# EAGLE schematic WS2811Controller (EAGLE 6.4)
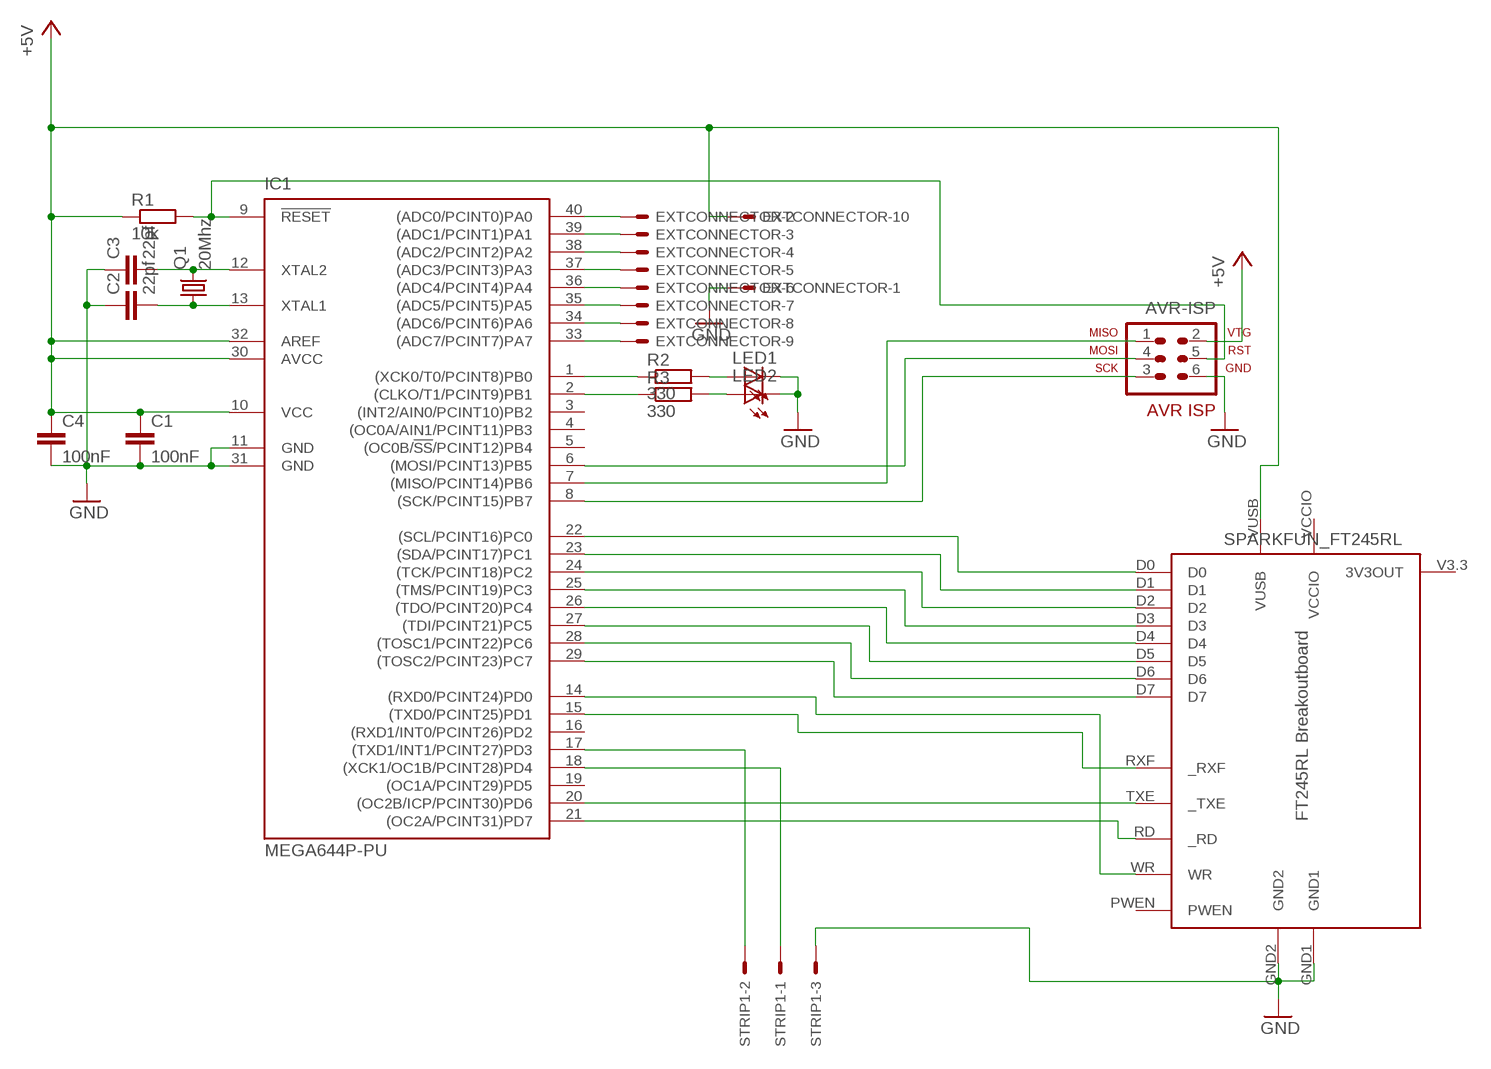
[diagram p0: schematic, sheet 1]

## Parts
AVR-ISP  AVR-ISP-6  [AVR-ISP-6]
C1  100nF  C-EU025-025X050  [C025-025X050]
C2  22pf  C-EU025-025X050  [C025-025X050]
C3  22pf  C-EU025-025X050  [C025-025X050]
C4  100nF  C-EU025-025X050  [C025-025X050]
EXTCONNECTOR  22-27-2101-10  [6410-10]
IC1  MEGA644P-PU  MEGA164P/324P/644P-PU  [DIL40]
LED1  LED3MM  [LED3MM]
LED2  LED3MM  [LED3MM]
Q1  20Mhz  CRYSTALHC49U-V  [HC49U-V]
R1  10k  R-EU_0207/10  [0207/10]
R2  330  R-EU_0207/10  [0207/10]
R3  330  R-EU_0207/10  [0207/10]
SPARKFUN_FT245RL  FT245RL_BREAKOUTBOARD  [SPARKFUN_FT245RL_BOARD]
STRIP1  22-27-2031-03  [6410-03]

## Nets
+5V: AVR-ISP.2 C1.1 C4.1 EXTCONNECTOR.10 IC1.10(VCC) IC1.30(AVCC) IC1.32(AREF) R1.1 SPARKFUN_FT245RL.VUSB
GND: AVR-ISP.6 C1.2 C2.1 C3.1 C4.2 EXTCONNECTOR.1 IC1.11(GND) IC1.31(GND) LED1.K(C) LED2.K(C) SPARKFUN_FT245RL.GND1 SPARKFUN_FT245RL.GND2 STRIP1.3
N$1: AVR-ISP.3 IC1.8((SCK/PCINT15)PB7)
N$2: AVR-ISP.1 IC1.7((MISO/PCINT14)PB6)
N$3: IC1.1((XCK0/T0/PCINT8)PB0) R2.1
N$4: AVR-ISP.5 IC1.9(!RESET) R1.2
N$5: AVR-ISP.4 IC1.6((MOSI/PCINT13)PB5)
N$6: IC1.2((CLKO/T1/PCINT9)PB1) R3.1
N$7: IC1.22((SCL/PCINT16)PC0) SPARKFUN_FT245RL.D0
N$8: C2.2 IC1.13(XTAL1) Q1.1
N$9: C3.2 IC1.12(XTAL2) Q1.2
N$10: IC1.23((SDA/PCINT17)PC1) SPARKFUN_FT245RL.D1
N$11: IC1.24((TCK/PCINT18)PC2) SPARKFUN_FT245RL.D2
N$12: IC1.25((TMS/PCINT19)PC3) SPARKFUN_FT245RL.D3
N$13: IC1.26((TDO/PCINT20)PC4) SPARKFUN_FT245RL.D4
N$14: IC1.27((TDI/PCINT21)PC5) SPARKFUN_FT245RL.D5
N$15: IC1.28((TOSC1/PCINT22)PC6) SPARKFUN_FT245RL.D6
N$16: IC1.29((TOSC2/PCINT23)PC7) SPARKFUN_FT245RL.D7
N$17: IC1.20((OC2B/ICP/PCINT30)PD6) SPARKFUN_FT245RL.TXE(_TXE)
N$18: IC1.15((TXD0/PCINT25)PD1) SPARKFUN_FT245RL.RXF(_RXF)
N$19: IC1.21((OC2A/PCINT31)PD7) SPARKFUN_FT245RL.RD(_RD)
N$20: IC1.14((RXD0/PCINT24)PD0) SPARKFUN_FT245RL.WR
N$21: LED1.A R2.2
N$22: LED2.A R3.2
N$23: IC1.18((XCK1/OC1B/PCINT28)PD4) STRIP1.1
N$24: EXTCONNECTOR.2 IC1.40((ADC0/PCINT0)PA0)
N$25: IC1.17((TXD1/INT1/PCINT27)PD3) STRIP1.2
N$26: EXTCONNECTOR.3 IC1.39((ADC1/PCINT1)PA1)
N$27: EXTCONNECTOR.4 IC1.38((ADC2/PCINT2)PA2)
N$28: EXTCONNECTOR.5 IC1.37((ADC3/PCINT3)PA3)
N$29: EXTCONNECTOR.6 IC1.36((ADC4/PCINT4)PA4)
N$30: EXTCONNECTOR.7 IC1.35((ADC5/PCINT5)PA5)
N$31: EXTCONNECTOR.8 IC1.34((ADC6/PCINT6)PA6)
N$32: EXTCONNECTOR.9 IC1.33((ADC7/PCINT7)PA7)
Unconnected: IC1.3((INT2/AIN0/PCINT10)PB2) IC1.4((OC0A/AIN1/PCINT11)PB3) IC1.5((OC0B/!SS!/PCINT12)PB4) IC1.16((RXD1/INT0/PCINT26)PD2) IC1.19((OC1A/PCINT29)PD5) SPARKFUN_FT245RL.PWEN SPARKFUN_FT245RL.V3.3(3V3OUT)

## Power pins joined to a net without a drawn wire
VCCIO: SPARKFUN_FT245RL.VCCIO

## Library data of the parts
AVR-ISP = 0_avr:AVR-ISP-6: AVR ISP-6 Serial Programming Header
C1-C4 = 0_Standard-Parts:C-EU: CAPACITOR, European symbol
EXTCONNECTOR = con-molex:22-?-10: CONNECTOR wire to board 2.54 mm (.1 inch) pitch header; OC_FARNELL: unknown; OC_NEWARK: unknown
IC1 = 0_avr:MEGA164P/324P/644P-PU
LED1 LED2 = 0_Led:LED: LED
Q1 = 0_tom parts:CRYSTAL: CRYSTAL; OC_FARNELL: 1666969; OC_NEWARK: unknown
R1-R3 = 0_Standard-Parts:R-EU_: RESISTOR, European symbol
SPARKFUN_FT245RL = Sparkfun:FT245RL_BREAKOUTBOARD: Sparkfun FT245RL Breakoutboard
STRIP1 = con-molex:22-?-03: CONNECTOR wire to board 2.54 mm (.1 inch) pitch header; OC_FARNELL: unknown; OC_NEWARK: unknown